# Altium schematic sheet MicroSdCard.SchDoc
size 420 x 297 mm; DocumentNumber: MicroSdCard
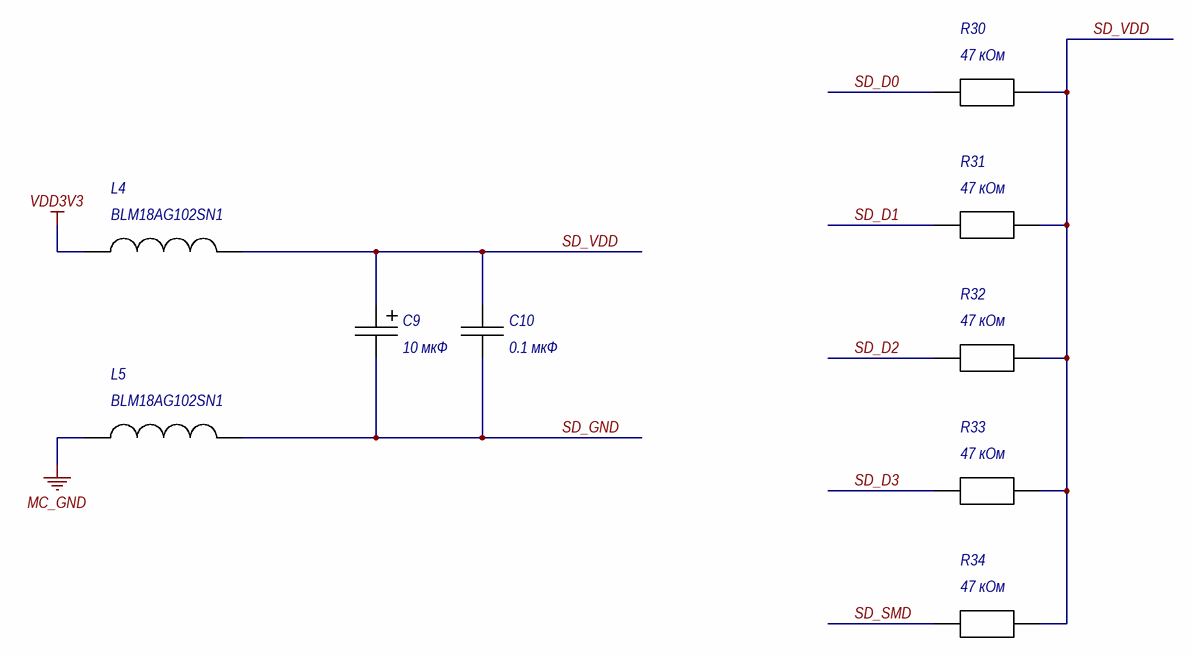
[diagram p0: MicroSdCard.SchDoc]

## Parts
C9  10 мкФ  [C TAN_A]
C10  0.1 мкФ  [C 0805]
L4  BLM18AG102SN1  [FB 0603]
L5  BLM18AG102SN1  [FB 0603]
R30  47 кОм  [RES 0402]
R31  47 кОм  [RES 0402]
R32  47 кОм  [RES 0402]
R33  47 кОм  [RES 0402]
R34  47 кОм  [RES 0402]

## Nets
MC_GND: L5.1
VDD3V3: L4.1
SD_D0: R30.2
SD_D1: R31.2
SD_D2: R32.2
SD_D3: R33.2
SD_GND: C9.2 C10.2 L5.2
SD_SMD: R34.2
SD_VDD: C9.1 C10.1 L4.2 R30.1 R31.1 R32.1 R33.1 R34.1

## Notes on the sheet
- Подп. и дата
- Инв. № дубл.
- Взам. инв. №
- Инв. № подл.
- Лист
- Изм.
- № докум.
- Подп.
- Дата
- Копировал
- Формат А3

## Library data of the parts
C9 = CAP TAN_A: SMD Tantalium Capacitor A; Type: Конденсатор танталовый; Rated voltage: 16; Size: A
C10 = CAP 0805: SMD Capacitor 0805; Manufacturer: /Укажите компанию-производителя/; Tolerance: /Укажите допуск в процентах/; Temperature coefficient: /Формат: ±? ppm/°C/; Type: Конденсатор керамический; TC: /Укажите тип диэлектрика/; Size: 0805; Temperature range: /Формат: -? ... ? °C/
R30-R34 = RES 0402